# Altium project FAT51.PrjPCB
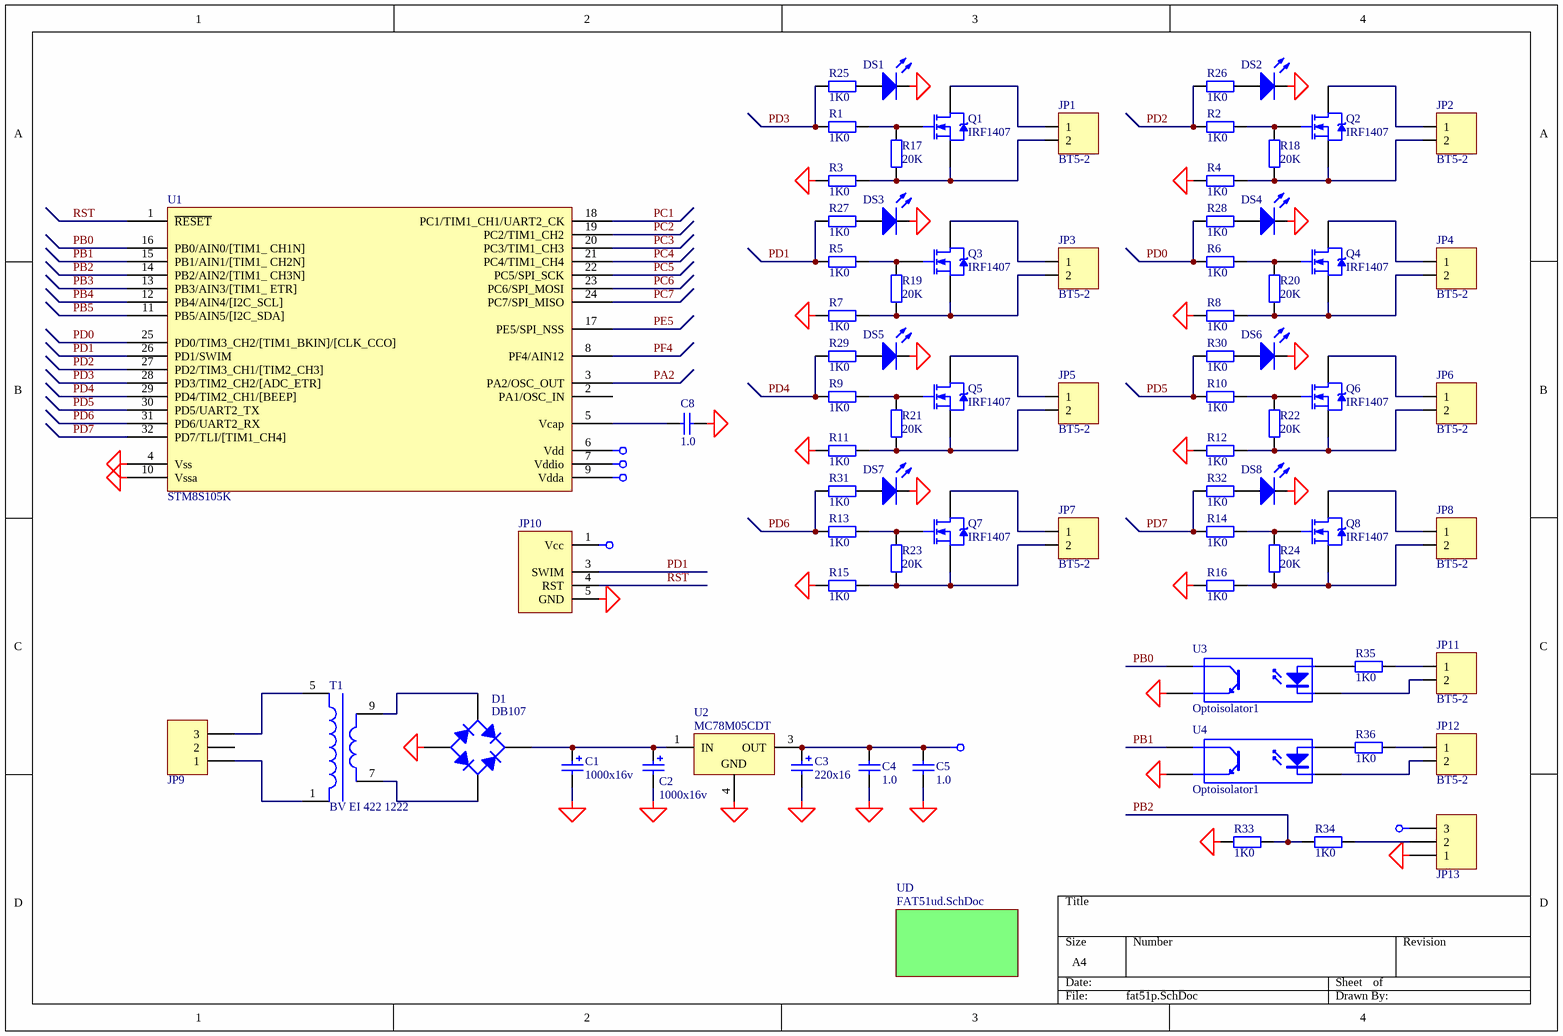
[diagram p0: fat51p.SchDoc]
2 sheets, 125 parts. Net scope: global (net labels, ports and power ports of the same name join across sheets).
Board file: FAT51.PcbDoc
Sheets:
  fat51p.SchDoc
    UD = fat51ud.SchDoc

## Sheet fat51p.SchDoc
size A4

### Parts
C1  value 1000x16v  [el5]
C2  value 1000x16v  [el5]
C3  value 220x16  [el3]
C4  value 1.0  [_1206]  (hidden comment: Cap)
C5  value 1.0  [_1206]  (hidden comment: Cap)
C8  1.0  [_1206]
D1  DB107  [DF01]
DS1  LED0  [el3]  (value not drawn)
DS2  LED0  [el3]  (value not drawn)
DS3  LED0  [el3]  (value not drawn)
DS4  LED0  [el3]  (value not drawn)
DS5  LED0  [el3]  (value not drawn)
DS6  LED0  [el3]  (value not drawn)
DS7  LED0  [el3]  (value not drawn)
DS8  LED0  [el3]  (value not drawn)
JP1  BT5-2  [BT5-2-1]
JP2  BT5-2  [BT5-2-1]
JP3  BT5-2  [BT5-2-1]
JP4  BT5-2  [BT5-2-1]
JP5  BT5-2  [BT5-2-1]
JP6  BT5-2  [BT5-2-1]
JP7  BT5-2  [BT5-2-1]
JP8  BT5-2  [BT5-2-1]
JP9  Header 3  [BT5-3]  (value not drawn)
JP10  (no value)  [HDR1X5_uart]
JP11  BT5-2  [BT5-2-1]
JP12  BT5-2  [BT5-2-1]
JP13  Header 3  [BT5-3]  (value not drawn)
Q1  IRF1407  [7805_2]
Q2  IRF1407  [7805_2]
Q3  IRF1407  [7805_2]
Q4  IRF1407  [7805_2]
Q5  IRF1407  [7805_2]
Q6  IRF1407  [7805_2]
Q7  IRF1407  [7805_2]
Q8  IRF1407  [7805_2]
R1  1K0  [_1206]
R2  1K0  [_1206]
R3  1K0  [_1206]
R4  1K0  [_1206]
R5  1K0  [_1206]
R6  1K0  [_1206]
R7  1K0  [_1206]
R8  1K0  [_1206]
R9  1K0  [_1206]
R10  1K0  [_1206]
R11  1K0  [_1206]
R12  1K0  [_1206]
R13  1K0  [_1206]
R14  1K0  [_1206]
R15  1K0  [_1206]
R16  1K0  [_1206]
R17  20K  [_1206]
R18  20K  [_1206]
R19  20K  [_1206]
R20  20K  [_1206]
R21  20K  [_1206]
R22  20K  [_1206]
R23  20K  [_1206]
R24  20K  [_1206]
R25  1K0  [_1206]
R26  1K0  [_1206]
R27  1K0  [_1206]
R28  1K0  [_1206]
R29  1K0  [_1206]
R30  1K0  [_1206]
R31  1K0  [_1206]
R32  1K0  [_1206]
R33  1K0  [_1206]
R34  1K0  [_1206]
R35  1K0  [_1206]
R36  1K0  [_1206]
T1  BV EI 422 1222  [BV EI 422 1226_L]
U1  STM8S105K  [QFP7X7-G32/X.5N]
U2  MC78M05CDT  [SIP-G3/Z11.05]
U3  Optoisolator1  [SO-G4]
U4  Optoisolator1  [SO-G4]

### Sub-sheets
UD = FAT51ud.SchDoc: no entries

### Nets
+5v: C3.1 C4.2 C5.2 JP10.1(Vcc) JP13.3 U1.6(Vdd) U1.7(Vddio) U1.9(Vdda) U2.3(OUT)
GND: C1.2 C2.2 C3.2 C4.1 C5.1 C8.1 D1.1(A) DS1.2(K) DS2.2(K) DS3.2(K) DS4.2(K) DS5.2(K) DS6.2(K) DS7.2(K) DS8.2(K) JP10.5(GND) JP13.1 R3.1 R4.1 R7.1 R8.1 R11.1 R12.1 R15.1 R16.1 R33.1 U1.4(Vss) U1.10(Vssa) U2.4(GND) U3.3(E) U4.3(E)
PA2: U1.3(PA2/OSC_OUT)
PB0: U1.16(PB0/AIN0/[TIM1__CH1N]) U3.4(C)
PB1: U1.15(PB1/AIN1/[TIM1__CH2N]) U4.4(C)
PB2: R33.2 R34.1 U1.14(PB2/AIN2/[TIM1__CH3N])
PB3: U1.13(PB3/AIN3/[TIM1__ETR])
PB4: U1.12(PB4/AIN4/[I2C_SCL])
PB5: U1.11(PB5/AIN5/[I2C_SDA])
PC1: U1.18(PC1/TIM1_CH1/UART2_CK)
PC2: U1.19(PC2/TIM1_CH2)
PC3: U1.20(PC3/TIM1_CH3)
PC4: U1.21(PC4/TIM1_CH4)
PC5: U1.22(PC5/SPI_SCK)
PC6: U1.23(PC6/SPI_MOSI)
PC7: U1.24(PC7/SPI_MISO)
PD0: R6.1 R28.1 U1.25(PD0/TIM3_CH2/[TIM1_BKIN]/[CLK_CCO])
PD1: JP10.3(SWIM) R5.1 R27.1 U1.26(PD1/SWIM)
PD2: R2.1 R26.1 U1.27(PD2/TIM3_CH1/[TIM2_CH3])
PD3: R1.1 R25.1 U1.28(PD3/TIM2_CH2/[ADC_ETR])
PD4: R9.1 R29.1 U1.29(PD4/TIM2_CH1/[BEEP])
PD5: R10.1 R30.1 U1.30(PD5/UART2_TX)
PD6: R13.1 R31.1 U1.31(PD6/UART2_RX)
PD7: R14.1 R32.1 U1.32(PD7/TLI/[TIM1_CH4])
PE5: U1.17(PE5/SPI_NSS)
PF4: U1.8(PF4/AIN12)
RST: JP10.4(RST) U1.1(~{RESET})
NetC1_1: C1.1 C2.1 D1.3(K) U2.1(IN)
NetC8_2: C8.2 U1.5(Vcap)
NetD1_2: D1.2(C) T1.9(Sec1-)
NetD1_4: D1.4(C) T1.7(Sec1+)
NetDS1_1: DS1.1(A) R25.2
NetDS2_1: DS2.1(A) R26.2
NetDS3_1: DS3.1(A) R27.2
NetDS4_1: DS4.1(A) R28.2
NetDS5_1: DS5.1(A) R29.2
NetDS6_1: DS6.1(A) R30.2
NetDS7_1: DS7.1(A) R31.2
NetDS8_1: DS8.1(A) R32.2
NetJP1_1: JP1.1 Q1.2(D)
NetJP1_2: JP1.2 Q1.3(S) R3.2 R17.2
NetJP2_1: JP2.1 Q2.2(D)
NetJP2_2: JP2.2 Q2.3(S) R4.2 R18.2
NetJP3_1: JP3.1 Q3.2(D)
NetJP3_2: JP3.2 Q3.3(S) R7.2 R19.2
NetJP4_1: JP4.1 Q4.2(D)
NetJP4_2: JP4.2 Q4.3(S) R8.2 R20.2
NetJP5_1: JP5.1 Q5.2(D)
NetJP5_2: JP5.2 Q5.3(S) R11.2 R21.2
NetJP6_1: JP6.1 Q6.2(D)
NetJP6_2: JP6.2 Q6.3(S) R12.2 R22.2
NetJP7_1: JP7.1 Q7.2(D)
NetJP7_2: JP7.2 Q7.3(S) R15.2 R23.2
NetJP8_1: JP8.1 Q8.2(D)
NetJP8_2: JP8.2 Q8.3(S) R16.2 R24.2
NetJP9_1: JP9.1 T1.1(Pri+)
NetJP9_3: JP9.3 T1.5(Pri-)
NetJP11_1: JP11.1 R35.2
NetJP11_2: JP11.2 U3.2(K)
NetJP12_1: JP12.1 R36.2
NetJP12_2: JP12.2 U4.2(K)
NetJP13_2: JP13.2 R34.2
NetQ1_1: Q1.1(G) R1.2 R17.1
NetQ2_1: Q2.1(G) R2.2 R18.1
NetQ3_1: Q3.1(G) R5.2 R19.1
NetQ4_1: Q4.1(G) R6.2 R20.1
NetQ5_1: Q5.1(G) R9.2 R21.1
NetQ6_1: Q6.1(G) R10.2 R22.1
NetQ7_1: Q7.1(G) R13.2 R23.1
NetQ8_1: Q8.1(G) R14.2 R24.1
NetR35_1: R35.1 U3.1(A)
NetR36_1: R36.1 U4.1(A)

Not connected (* = marked no-connect by the designer): JP9 2; U1 2(PA1/OSC_IN)

### Library data of the parts
C1 C2 = Cap Pol1: Polarized Capacitor (Radial); Manufacturer: Generic Components; Class I: Passive; Published: 8-Jun-2000; Revision: July-2002: Re-released for DXP Platform.; Publisher: Altium Limited; Class II: Capacitor
C3 = Cap Pol: Polarized Capacitor (Radial); Manufacturer: Generic Components; Class I: Passive; Published: 8-Jun-2000; Revision: July-2002: Re-released for DXP Platform.; Publisher: Altium Limited; Class II: Capacitor
C4 C5 = Cap: Capacitor; Manufacturer: Generic Components; Class I: Passive; Published: 8-Jun-2000; Revision: July-2002: Re-released for DXP Platform.; Publisher: Altium Limited; Class II: Capacitor
C8 = Cap Semi: Capacitor (Semiconductor SIM Model); Manufacturer: Generic Components; Class I: Passive; Value: 0,1; Published: 8-Jun-2000; Revision: July-2002: Re-released for DXP Platform.; Publisher: Altium Limited; Class II: Capacitor
D1 = Bridge1: Full Wave Diode Bridge; Manufacturer: Generic Components; Class I: Discrete; Class II: Rectifier - Bridge; Published: 8-Jun-2000; Revision: July-2002: Re-released for DXP Platform.; Publisher: Altium Limited
DS1-DS8 = LED0: Typical INFRARED GaAs LED; Manufacturer: Generic Components; Class I: Optoelectronic; Published: 8-Jun-2000; Revision: July-2002: Re-released for DXP Platform.; Publisher: Altium Limited; Class II: LED
JP1-JP8 JP11 JP12 = BT5-2: Header, 3-Pin; Manufacturer: Generic Components; Class I: Connector; Revision: July-2002: Re-released for DXP Platform.; Publisher: Altium Limited
JP9 JP13 = Header 3: Header, 3-Pin; Manufacturer: Generic Components; Class I: Connector; Revision: July-2002: Re-released for DXP Platform.; Publisher: Altium Limited
JP10 = SWIM_CONN
Q1-Q8 = IRFR120: HEXFET N-Channel Power MOSFET; Manufacturer: International Rectifier; Revision 1: 10-July-2000: SIM Model Added.; Revision 2: July-2002: Re-released for DXP Platform.; Class I: Discrete; Class II: MOSFET - Power; Note: Pin 2 is trimmed and is electrically connected to Drain.; Published: 8-Jun-2000; Datasheet: Latest Revision: PD-9.523D; Package Reference: TO-252AA; Publisher: Altium Limited
R1-R36 = Res2: Resistor; Manufacturer: Generic Components; Class I: Passive; Value: 1K; Published: 8-Jun-2000; Revision: July-2002: Re-released for DXP Platform.; Publisher: Altium Limited; Class II: Resistor
T1 = BV EI 302: Manufacturer: Generic Components; Class I: Passive; Class II: Transformer; Published: 25-Jan-2001; Revision: July-2002: Re-released for DXP Platform.; Publisher: Altium Limited
U2 = MC78M05CDT: Three-Terminal Medium Current Positive Voltage Regulator; Manufacturer: ON Semiconductor; Package Information: Latest Revision: 1997; Class I: Power Management; Note: Pin 2 is electrically connected to Pin 4; Pin 2 is trimmed and not drawn;; Published: 15-Apr-2002; Datasheet: Latest Revision: Apr-2000; Package Reference: 369A-13; Publisher: Altium Limited; Class II: Voltage Regulator
U3 U4 = Optoisolator1: Optoisolator; Manufacturer: Generic Components; Class I: Optoelectronic; Published: 24-Mar-1999; Revision: July-2002: Re-released for DXP Platform.; Publisher: Altium Limited

## Sheet fat51ud.SchDoc
size A3
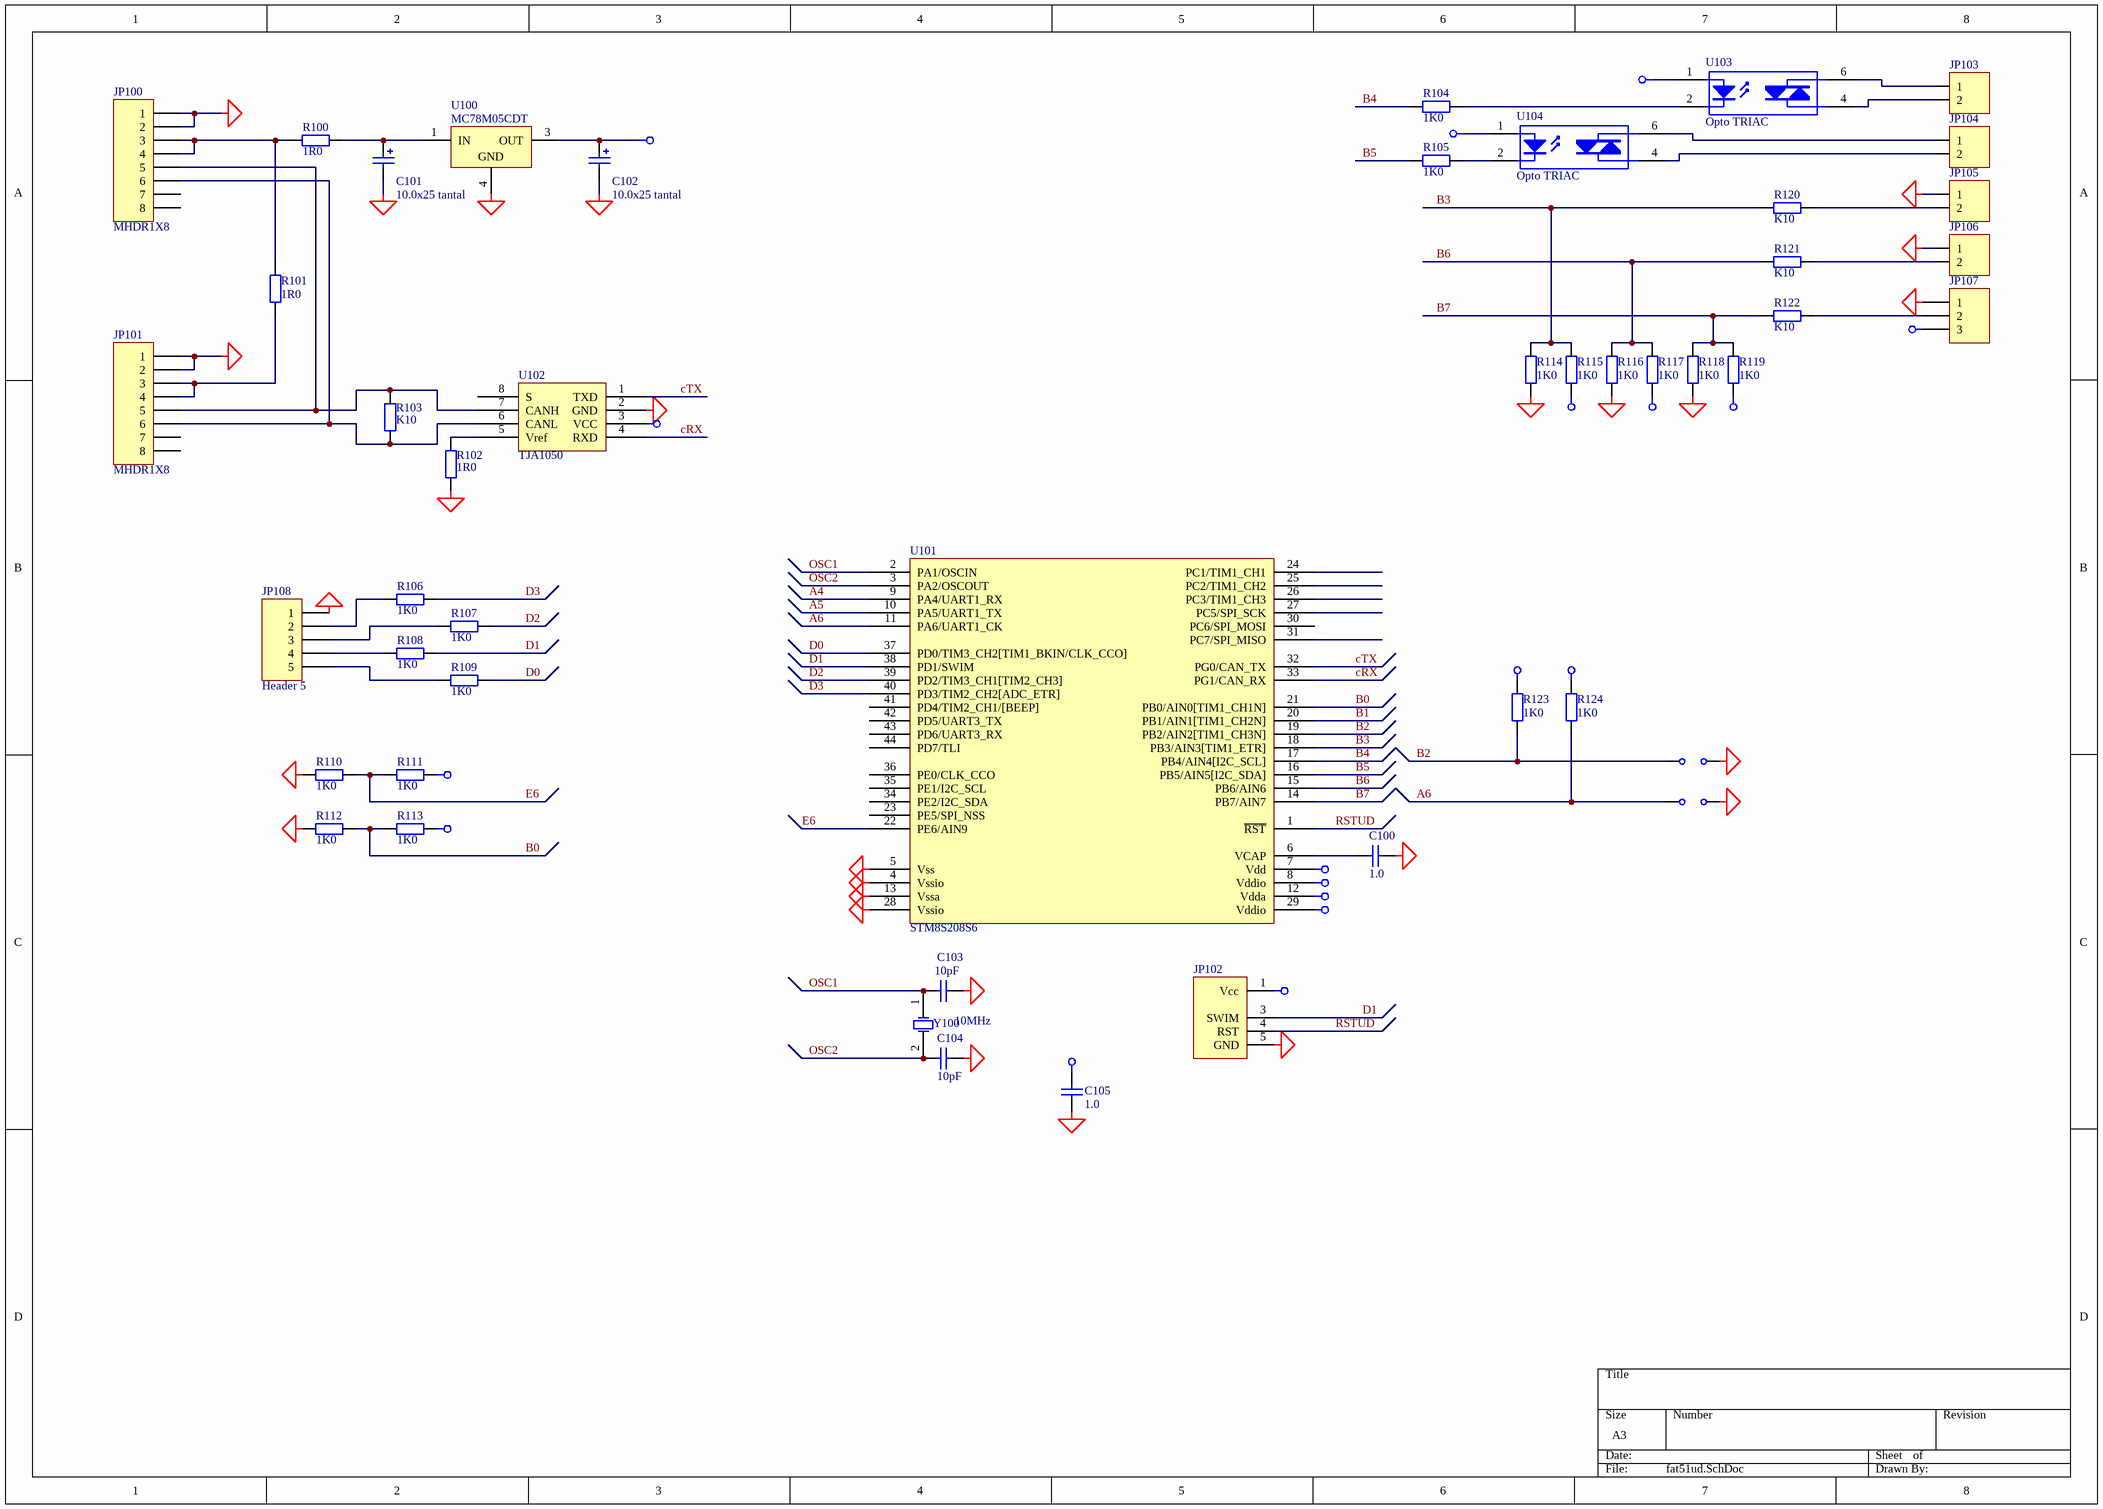
[diagram p1: fat51ud.SchDoc]

### Parts
C100  1.0  [_0805]
C101  10.0x25 tantal  [CAP_EL_6_3]
C102  10.0x25 tantal  [CAP_EL_6_3]
C103  10pF  [_0805]
C104  10pF  [_0805]
C105  1.0  [_0805]
J1  (no value)  [jmp]
J2  (no value)  [jmp]
JP100  MHDR1X8  [8i8p-5306]
JP101  MHDR1X8  [8i8p-5306]
JP102  (no value)  [HDR1X5_uart]
JP103  BT5-2  [BT5-2-1]  (value not drawn)
JP104  BT5-2  [BT5-2-1]  (value not drawn)
JP105  BT5-2  [BT5-2-1]  (value not drawn)
JP106  BT5-2  [BT5-2-1]  (value not drawn)
JP107  Header 3  [BT5-3]  (value not drawn)
JP108  Header 5  [HDR1X5]
R100  1R0  [_0805]
R101  1R0  [_0805]
R102  1R0  [_0805]
R103  K10  [_0805]
R104  1K0  [_0805]
R105  1K0  [_0805]
R106  1K0  [_0805]
R107  1K0  [_0805]
R108  1K0  [_0805]
R109  1K0  [_0805]
R110  1K0  [_0805]
R111  1K0  [_0805]
R112  1K0  [_0805]
R113  1K0  [_0805]
R114  1K0  [_0805]
R115  1K0  [_0805]
R116  1K0  [_0805]
R117  1K0  [_0805]
R118  1K0  [_0805]
R119  1K0  [_0805]
R120  K10  [_0805]
R121  K10  [_0805]
R122  K10  [_0805]
R123  1K0  [_0805]
R124  1K0  [_0805]
U100  MC78M05CDT  [SIP-G3/Z11.05]
U101  STM8S208S6  [QFP10X10-G44/G10N]
U102  TJA1050  [SO-G8/D5]
U103  Opto TRIAC  [dip-6]
U104  Opto TRIAC  [dip-6]
Y100  10MHz  [QWARZ1]

### Nets
+5v_ud: C102.1 C105.1 JP102.1(Vcc) JP107.3 R111.1 R113.1 R115.2 R117.2 R119.2 R123.1 R124.1 U100.3(OUT) U101.7(Vdd) U101.8(Vddio) U101.12(Vdda) U101.29(Vddio) U102.3(VCC) U103.1(A) U104.1(A)
GNDUD: C100.1 C101.2 C102.2 C103.1 C104.1 C105.2 J1.1 J2.1 JP100.1 JP100.2 JP101.1 JP101.2 JP102.5(GND) JP105.1 JP106.1 JP107.1 JP108.1 R102.1 R110.2 R112.2 R114.2 R116.2 R118.2 U100.4(GND) U101.4(Vssio) U101.13(Vssa) U101.28(Vssio) U102.2(GND)
UD: U101.5(Vss)
A4: U101.9(PA4/UART1_RX)
A5: U101.10(PA5/UART1_TX)
A6: J1.2 R124.2 U101.11(PA6/UART1_CK)
B0: R112.1 R113.2 U101.21(PB0/AIN0[TIM1_CH1N])
B1: U101.20(PB1/AIN1[TIM1_CH2N])
B2: J2.2 R123.2 U101.19(PB2/AIN2[TIM1_CH3N])
B3: R114.1 R115.1 R120.2 U101.18(PB3/AIN3[TIM1_ETR])
B4: R104.2 U101.17(PB4/AIN4[I2C_SCL])
B5: R105.2 U101.16(PB5/AIN5[I2C_SDA])
B6: R116.1 R117.1 R121.2 U101.15(PB6/AIN6)
B7: R118.1 R119.1 R122.2 U101.14(PB7/AIN7)
cRX: U101.33(PG1/CAN_RX) U102.4(RXD)
cTX: U101.32(PG0/CAN_TX) U102.1(TXD)
D0: R109.1 U101.37(PD0/TIM3_CH2[TIM1_BKIN/CLK_CCO])
D1: JP102.3(SWIM) R108.1 U101.38(PD1/SWIM)
D2: R107.1 U101.39(PD2/TIM3_CH1[TIM2_CH3])
D3: R106.1 U101.40(PD3/TIM2_CH2[ADC_ETR])
E6: R110.1 R111.2 U101.22(PE6/AIN9)
OSC1: C103.2 U101.2(PA1/OSCIN) Y100.1(OSC1)
OSC2: C104.2 U101.3(PA2/OSCOUT) Y100.2(OSC2)
RSTUD: JP102.4(RST) U101.1(~{RST})
NetC100_2: C100.2 U101.6(VCAP)
NetC101_1: C101.1 R100.2 U100.1(IN)
NetJP100_3: JP100.3 JP100.4 R100.1 R101.2
NetJP100_5: JP100.5 JP101.5 R103.2 U102.7(CANH)
NetJP100_6: JP100.6 JP101.6 R103.1 U102.6(CANL)
NetJP101_3: JP101.3 JP101.4 R101.1
NetJP103_1: JP103.1 U103.6(A/K)
NetJP103_2: JP103.2 U103.4(A/K)
NetJP104_1: JP104.1 U104.6(A/K)
NetJP104_2: JP104.2 U104.4(A/K)
NetJP105_2: JP105.2 R120.1
NetJP106_2: JP106.2 R121.1
NetJP107_2: JP107.2 R122.1
NetJP108_2: JP108.2 R106.2
NetJP108_3: JP108.3 R107.2
NetJP108_4: JP108.4 R108.2
NetJP108_5: JP108.5 R109.2
NetR102_2: R102.2 U102.5(Vref)
NetR104_1: R104.1 U103.2(K)
NetR105_1: R105.1 U104.2(K)

Not connected (* = marked no-connect by the designer): JP100 7 8; JP101 7 8; U101 23(PE5/SPI_NSS) 24(PC1/TIM1_CH1) 25(PC2/TIM1_CH2) 26(PC3/TIM1_CH3) 27(PC5/SPI_SCK) 30(PC6/SPI_MOSI) 31(PC7/SPI_MISO) 34(PE2/I2C_SDA) 35(PE1/I2C_SCL) 36(PE0/CLK_CCO) 41(PD4/TIM2_CH1/[BEEP]) 42(PD5/UART3_TX) 43(PD6/UART3_RX) 44(PD7/TLI); U102 8(S)

### Library data of the parts
C100 C105 = Cap Semi: Capacitor (Semiconductor SIM Model); Manufacturer: Generic Components; Class I: Passive; Value: 1,0; Published: 8-Jun-2000; Revision: July-2002: Re-released for DXP Platform.; Publisher: Altium Limited; Class II: Capacitor
C101 C102 = Cap Pol1: Polarized Capacitor (Radial); Manufacturer: Generic Components; Class I: Passive; Value: 10,0x25; Published: 8-Jun-2000; Revision: July-2002: Re-released for DXP Platform.; Publisher: Altium Limited; Class II: Capacitor
C103 C104 = Cap Semi: Capacitor (Semiconductor SIM Model); Manufacturer: Generic Components; Class I: Passive; Value: 15pF; Published: 8-Jun-2000; Revision: July-2002: Re-released for DXP Platform.; Publisher: Altium Limited; Class II: Capacitor
J1 J2 = JMP: Switch; Manufacturer: Generic Components; Published: 24-Mar-1999; Revision: July-2002: Re-released for DXP Platform.; Publisher: Altium Limited
JP100 JP101 = MHDR1X8: Header, 8-Pin; Manufacturer: Generic Components; Class I: Connector; Revision: July-2002: Re-released for DXP Platform.; Publisher: Altium Limited
JP102 = SWIM_CONN
JP103-JP106 = BT5-2: as JP1 on sheet fat51p; Revision: July-2002: Re-released for DXP Platform.; Publisher: Altium Limited
JP107 = Header 3: as JP9 on sheet fat51p; Revision: July-2002: Re-released for DXP Platform.; Publisher: Altium Limited
JP108 = Header 5: Header, 5-Pin; Manufacturer: Generic Components; Class I: Connector; Revision: July-2002: Re-released for DXP Platform.; Publisher: Altium Limited
R100 R101 R104-R119 R123 R124 = Res2: as R1 on sheet fat51p; Published: 8-Jun-2000; Revision: July-2002: Re-released for DXP Platform.; Publisher: Altium Limited; Class II: Resistor
R102 R103 R120-R122 = Res2: Resistor; Manufacturer: Generic Components; Class I: Passive; Value: 120; Published: 8-Jun-2000; Revision: July-2002: Re-released for DXP Platform.; Publisher: Altium Limited; Class II: Resistor
U100 = MC78M05CDT: as U2 on sheet fat51p; Published: 15-Apr-2002; Datasheet: Latest Revision: Apr-2000; Package Reference: 369A-13; Publisher: Altium Limited; Class II: Voltage Regulator
U103 U104 = Opto TRIAC: Opto-Triac; Manufacturer: Generic Components; Class I: Optoelectronic; Published: 24-Mar-1999; Revision: July-2002: Re-released for DXP Platform.; Publisher: Altium Limited
Y100 = XTAL: Crystal Oscillator; Manufacturer: Generic Components; Published: 8-Jun-2000; Revision: July-2002: Re-released for DXP Platform.; Publisher: Altium Limited; Class I: Oscillator; Class II: Crystal Oscillator; Value: 10MHz